# Altium project wiz55stm32.PrjPcb
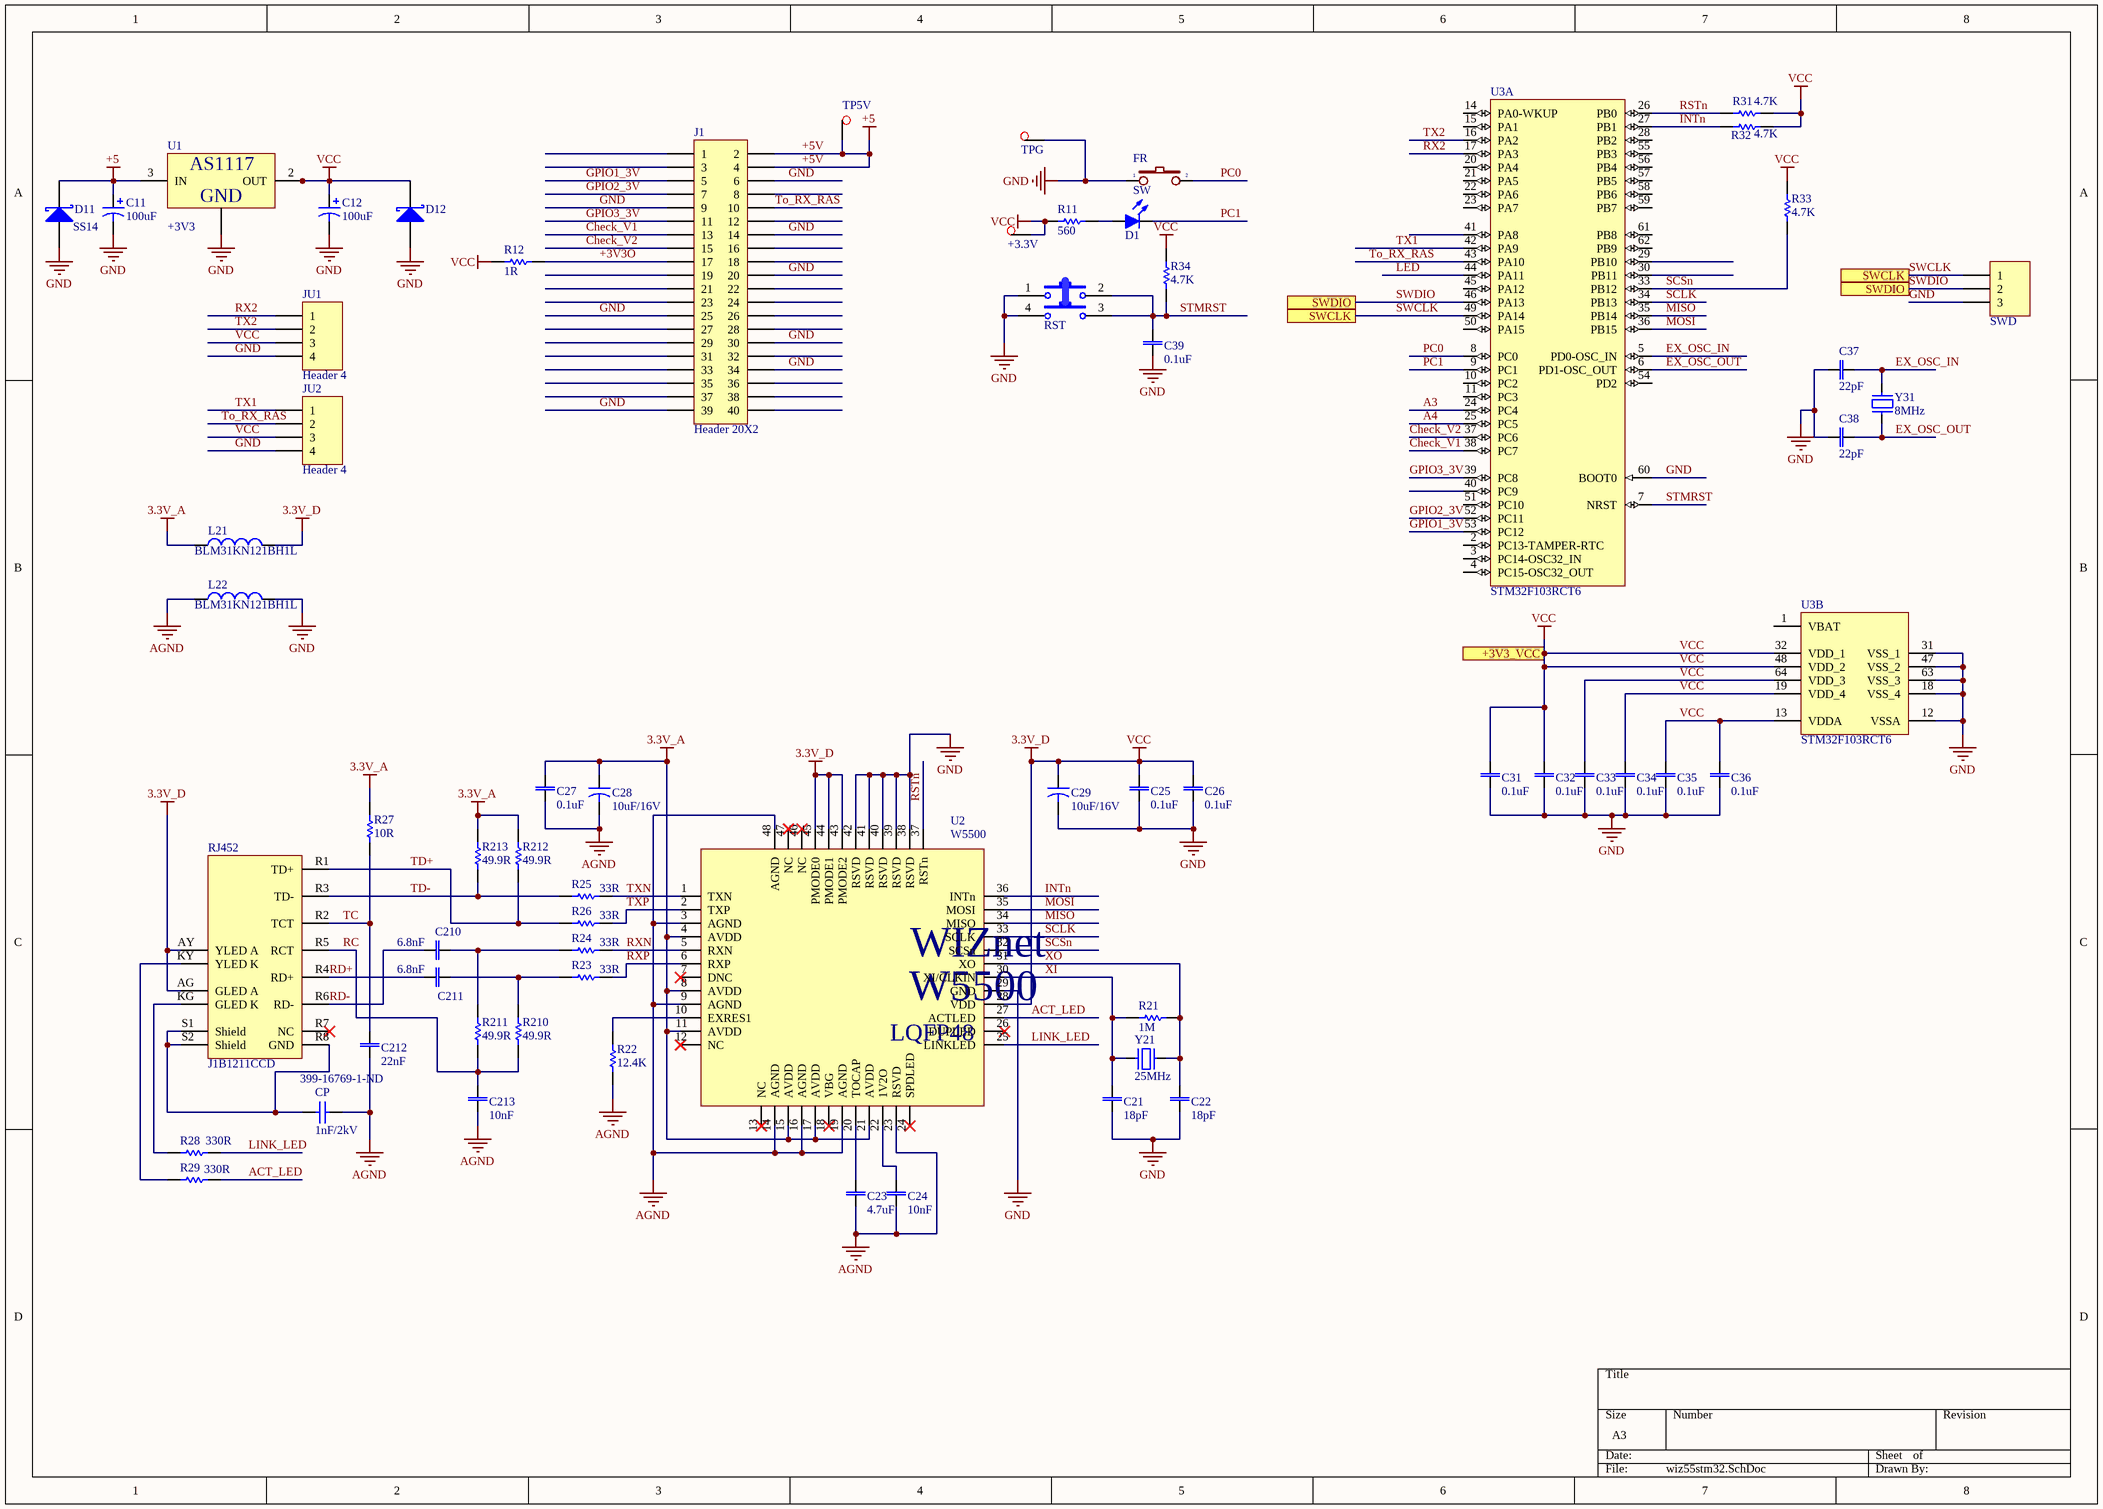
[diagram p0: wiz55stm32.SchDoc]
1 sheet, 64 parts. Net scope: flat (ports and power ports of the same name join across sheets).
Board file: wiz55stm32.PcbDoc

## Sheet wiz55stm32.SchDoc
size A3

### Parts
+3.3V  TP  [TP2]  (value not drawn)
C11  value 100uF  [CAP 3.8mm]  (hidden comment: Cap)
C12  value 100uF  [CAP 3.8mm]  (hidden comment: Cap)
C21  value 18pF  [CAP 0805]  (hidden comment: Tụ điện dán 080518pF)
C22  value 18pF  [CAP 0805]  (hidden comment: Tụ điện dán 080518pF)
C23  value 4.7uF  [CAP 0805]  (hidden comment: Tụ điện dán 08054.7uF)
C24  value 10nF  [CAP 0805]  (hidden comment: Tụ điện dán 080510nF)
C25  value 0.1uF  [CAP 0805]  (hidden comment: Tụ điện dán 08050.1uF)
C26  value 0.1uF  [CAP 0805]  (hidden comment: Tụ điện dán 08050.1uF)
C27  value 0.1uF  [CAP 0805]  (hidden comment: Tụ điện dán 08050.1uF)
C28  10uF/16V  [CAP-A Size]
C29  10uF/16V  [CAP-A Size]
C31  value 0.1uF  [CAP 0805]  (hidden comment: Tụ điện dán 08050.1uF)
C32  value 0.1uF  [CAP 0805]  (hidden comment: Tụ điện dán 08050.1uF)
C33  value 0.1uF  [CAP 0805]  (hidden comment: Tụ điện dán 08050.1uF)
C34  value 0.1uF  [CAP 0805]  (hidden comment: Tụ điện dán 08050.1uF)
C35  value 0.1uF  [CAP 0805]  (hidden comment: Tụ điện dán 08050.1uF)
C36  value 0.1uF  [CAP 0805]  (hidden comment: Tụ điện dán 08050.1uF)
C37  value 22pF  [CAP 0805]  (hidden comment: Tụ điện dán 080522pF)
C38  value 22pF  [CAP 0805]  (hidden comment: Tụ điện dán 080522pF)
C39  value 0.1uF  [CAP 0805]  (hidden comment: Tụ điện dán 08050.1uF)
C210  value 6.8nF  [CAP 0805]  (hidden comment: Tụ điện dán 08056.8nF)
C211  value 6.8nF  [CAP 0805]  (hidden comment: Tụ điện dán 08056.8nF)
C212  value 22nF  [CAP 0805]  (hidden comment: Tụ điện dán 080522nF)
C213  value 10nF  [CAP 0805]  (hidden comment: Tụ điện dán 080510nF)
CP  1nF/2kV  Supplier Part Number 1: 399-16769-1-ND  [CAP-1808]
D1  Led  [LED 5mm Green]  (value not drawn)
D11  value SS14  [DO-214AC]  (hidden comment: Đi ốt dánSS14)
D12  Đi ốt dánPN:CPDH3V3UP  [DO-35]  (value not drawn)
FR  SW  [SW2-D1]
J1  Header 20X2  [HDR2X20]
JU1  Header 4  [HDR1X4]
JU2  Header 4  [HDR1X4]
L21  BLM31KN121BH1L  [SMD 1206]
L22  BLM31KN121BH1L  [SMD 1206]
R11  value 560  [RES 0805]  (hidden comment: Điện trở dán 0603560)
R12  value 1R  [RES 0805]  (hidden comment: Điện trở dán 08051R)
R21  value 1M  [RES 0805]  (hidden comment: Điện trở dán 08051M)
R22  value 12.4K  [RES 0805]  (hidden comment: Điện trở dán 080512.4K)
R23  value 33R  [RES 0805]  (hidden comment: Điện trở dán 080533R)
R24  value 33R  [RES 0805]  (hidden comment: Điện trở dán 080533R)
R25  value 33R  [RES 0805]  (hidden comment: Điện trở dán 080533R)
R26  value 33R  [RES 0805]  (hidden comment: Điện trở dán 080533R)
R27  value 10R  [RES 0805]  (hidden comment: Điện trở dán 080510R)
R28  value 330R  [RES 0805]  (hidden comment: Điện trở dán 0805330R)
R29  value 330R  [RES 0805]  (hidden comment: Điện trở dán 0805330R)
R31  value 4.7K  [RES 0805]  (hidden comment: Điện trở dán 08054.7K)
R32  value 4.7K  [RES 0805]  (hidden comment: Điện trở dán 08054.7K)
R33  value 4.7K  [RES 0805]  (hidden comment: Điện trở dán 08054.7K)
R34  value 4.7K  [RES 0805]  (hidden comment: Điện trở dán 08054.7K)
R210  value 49.9R  [RES 0805]  (hidden comment: Điện trở dán 080549.9R)
R211  value 49.9R  [RES 0805]  (hidden comment: Điện trở dán 080549.9R)
R212  value 49.9R  [RES 0805]  (hidden comment: Điện trở dán 080549.9R)
R213  value 49.9R  [RES 0805]  (hidden comment: Điện trở dán 080549.9R)
RJ452  J1B1211CCD  [J1B1211CCD]
RST  Nút bấm 4 chân cắm12x12x6mm  [SW]  (value not drawn)
SWD  Header 3  [HDR1X3]  (value not drawn)
TP5V  TP  [TP2]  (value not drawn)
TPG  TP  [TP2]  (value not drawn)
U1  vl: +3V3  [SOT223-4N]  (hidden comment: IC nguồn AS1117 dán+3V3)
U2  W5500  [WIZnet W5500]
U3  STM32F103RCT6  [LQFP64_Tuan]  (parts A,B of 2)
Y21  25MHz  [XT2]
Y31  8MHz  [XT2]

### Ports
+3V3_VCC, SWCLK, SWDIO

### Nets
3.3V_A: C27.2 C28.1 L21.1 R27.1 R212.2 R213.2 U2.4(AVDD) U2.8(AVDD) U2.11(AVDD) U2.15(AVDD) U2.17(AVDD) U2.21(AVDD)
+5V: C11.1 D11.K J1.2 J1.4 TP5V.1 U1.3(IN)  [also labelled +5]
AGND: C23.1 C24.1 C27.1 C28.2 C212.2 C213.2 CP.1 L22.1 R22.1 U2.3(AGND) U2.9(AGND) U2.14(AGND) U2.16(AGND) U2.19(AGND) U2.23(RSVD) U2.48(AGND)
GND: C11.2 C12.2 C21.1 C22.1 C25.1 C26.1 C29.2 C31.1 C32.1 C33.1 C34.1 C35.1 C36.1 C37.2 C38.2 C39.1 D11.A D12.A FR.1 J1.6 J1.9 J1.14 J1.20 J1.25 J1.30 J1.34 J1.39 JU1.4 JU2.4 L22.2 RST.1 RST.4 SWD.3 TPG.1 U1.1(GND) U2.29(GND) U2.38(RSVD) U2.39(RSVD) U2.40(RSVD) U2.41(RSVD) U2.42(RSVD) U3.12(VSSA) U3.18(VSS_4) U3.31(VSS_1) U3.47(VSS_2) U3.60(BOOT0) U3.63(VSS_3)
VCC: +3.3V.1 C12.1 C25.2 C26.2 C29.1 C31.2 C32.2 C33.2 C34.2 C35.2 C36.2 D12.K JU1.3 JU2.3 L21.2 R11.1 R12.1 R31.1 R32.1 R33.2 R34.2 RJ452.AG(GLED_A) RJ452.AY(YLED_A) U1.2(OUT) U1.4 U2.28(VDD) U2.43(PMODE2) U2.44(PMODE1) U2.45(PMODE0) U3.13(VDDA) U3.19(VDD_4) U3.32(VDD_1) U3.48(VDD_2) U3.64(VDD_3) ; port +3V3_VCC  [also labelled 3.3V_D]
+3V3O: J1.17 R12.2
A3: U3.24(PC4)
A4: U3.25(PC5)
ACT_LED: R29.2 U2.27(ACTLED)
Check_V1: J1.13 U3.38(PC7)
Check_V2: J1.15 U3.37(PC6)
EX_OSC_IN: C37.1 U3.5(PD0-OSC_IN) Y31.2
EX_OSC_OUT: C38.1 U3.6(PD1-OSC_OUT) Y31.1
GPIO1_3V: J1.5 U3.53(PC12)
GPIO2_3V: J1.7 U3.52(PC11)
GPIO3_3V: J1.11 U3.39(PC8)
INTn: R32.2 U2.36(INTn) U3.27(PB1)
LED: U3.44(PA11)
LINK_LED: R28.2 U2.25(LINKLED)
MISO: U2.34(MISO) U3.35(PB14)
MOSI: U2.35(MOSI) U3.36(PB15)
PC0: FR.2 U3.8(PC0)
PC1: D1.K U3.9(PC1)
RC: C213.1 R210.1 R211.1 RJ452.R5(RCT)
RD+: C211.2 RJ452.R4(RD+)
RD-: C210.2 RJ452.R6(RD-)
RSTn: R31.2 U2.37(RSTn) U3.26(PB0)
RX2: JU1.1 U3.17(PA3)
RXN: R24.1 U2.5(RXN)
RXP: R23.1 U2.6(RXP)
SCLK: U2.33(SCLK) U3.34(PB13)
SCSn: R33.1 U2.32(SCSn) U3.33(PB12)
STMRST: C39.2 R34.1 RST.2 RST.3 U3.7(NRST)
SWCLK: SWD.1 U3.49(PA14) ; port SWCLK
SWDIO: SWD.2 U3.46(PA13) ; port SWDIO
TC: C212.1 R27.2 RJ452.R2(TCT)
TD+: R26.2 R212.1 RJ452.R1(TD+)
TD-: R25.2 R213.1 RJ452.R3(TD-)
To_RX_RAS: J1.10 JU2.2 U3.43(PA10)
TX1: JU2.1 U3.42(PA9)
TX2: JU1.2 U3.16(PA2)
TXN: R25.1 U2.1(TXN)
TXP: R26.1 U2.2(TXP)
XI: C21.2 R21.1 U2.30(XI/CLKIN) Y21.1
XO: C22.2 R21.2 U2.31(XO) Y21.2
NetC23_2: C23.2 U2.20(TOCAP)
NetC24_2: C24.2 U2.22(1V2O)
NetC210_1: C210.1 R24.2 R211.2
NetC211_1: C211.1 R23.2 R210.2
NetCP_2: CP.2 RJ452.R8(GND) RJ452.S1(Shield) RJ452.S2(Shield)
NetD1_A: D1.A R11.2
NetR22_2: R22.2 U2.10(EXRES1)
NetR28_1: R28.1 RJ452.KG(GLED_K)
NetR29_1: R29.1 RJ452.KY(YLED_K)

Not connected (* = marked no-connect by the designer): J1 1 3 8 12 16 18 19 21 22 23 24 26 27 28 29 31 32 33 35 36 37 38 40; RJ452 R7(NC)*; U2 7(DNC)* 12(NC)* 13(NC)* 18(VBG)* 24(SPDLED)* 26(DUPLED)* 46(NC)* 47(NC)*; U3 1(VBAT) 2(PC13-TAMPER-RTC) 3(PC14-OSC32_IN) 4(PC15-OSC32_OUT) 10(PC2) 11(PC3) 14(PA0-WKUP) 15(PA1) 20(PA4) 21(PA5) 22(PA6) 23(PA7) 28(PB2) 29(PB10) 30(PB11) 40(PC9) 41(PA8) 45(PA12) 50(PA15) 51(PC10) 54(PD2) 55(PB3) 56(PB4) 57(PB5) 58(PB6) 59(PB7) 61(PB8) 62(PB9)

### Notes on the sheet
- (in symbol W5500) WIZnet; LQFP48

### Library data of the parts
C21-C27 C31-C39 C210-C213 = CAP NP: Capacitor non polarized; cm1: Tụ điện dán 0603; cm3: Tụ điện dán 1206; cm2: Tụ điện dán 0805
C28 C29 = CAP-A Size: Tantla CAP A Size EIA/IECQ 3216
CP = CAP-1808: Ceramic CAP 1808(4520); Manufacturer 1: KEMET; Manufacturer Part Number 1: C1808C102MGRACAUTO; Capacitance: 1nF; Tolerance: 20%; Voltage Rating: 2kV; Supplier 1: Digi-Key; Stock 1: 3356; Pricing 1: 1=0.74000, 10=0.52000, 100=0.34230, 500=0.25358 (USD); RoHS: No; Mount: Surface Mount; Case/Package: 1808; Case Code (Imperial): 1808; Case Code (Metric): 4520; Min Operating Temperature: -55°C; Max Operating Temperature: 125°C; Packaging: Tape and Reel; Ratings: AEC-Q200; ComponentLink1URL: https://api.kemet.com/component-edge/download/datasheet/C1808C102MGRACAUTO.pdf?src-supplier=Digi-Key; ComponentLink1Description: https://api.kemet.com/component-edge/download/datasheet/C1808C102MGRACAUTO.pdf?src-supplier=Digi-Key
D1 = Led: pin to pad: A>1 K>2
D11 = Diodes Schottky: Schottky Diodes Through Hole 3 A 40 V Schottky Diodes, DO-201AD, SB340 ,MBR340; cm1: Đi ốt cắm; cm2: Đi ốt dán
D12 = Diodes Schottky: Zener 3.3V/1W; cm1: Đi ốt cắm; cm2: Đi ốt dán; Value: PN:CPDH3V3UP
FR = SW2: Switch button 2 pin; Value: SW chip 2 pin
J1 = Header 20X2: Header, 20-Pin, Dual row; LatestRevisionDate: 17-Jul-2002; LatestRevisionNote: Re-released for DXP Platform.; Publisher: Altium Limited
JU1 JU2 = Header 4: Header, 4-Pin; LatestRevisionDate: 17-Jul-2002; LatestRevisionNote: Re-released for DXP Platform.; Publisher: Altium Limited
L21 L22 = IND-0603: Ferrite Beads 1206 120ohms 4A AEC-Q200
R11 = Res: Resistor; cm2: Điện trở cắm 1/4W; cm3: Điện trở dán 0805; cm4: Điện trở dán 1206; cm1: Điện trở dán 0603
R12 R21-R29 R31-R34 R210-R213 = Res: Resistor; cm1: Điện trở dán 0603; cm2: Điện trở cắm 1/4W; cm4: Điện trở dán 1206; cm3: Điện trở dán 0805
RJ452 = BS-R250210
RST = SW-4P-Small: cm1: Nút bấm 4 chân cắm; vl1: 12x12x6mm
SWD = Header 3: Header, 3-Pin; LatestRevisionDate: 17-Jul-2002; LatestRevisionNote: Re-released for DXP Platform.; Publisher: Altium Limited
U1 = AS1117: cm: IC nguồn AS1117 dán
U2 = W5500: WIZnet W5500
U3 = STM32F103RCT6: ARM Cortex-M3 32-bit MCU, 256 KB Flash, 48 KB Internal RAM, 51 I/Os, 64-pin LQFP, -40 to 85 degC, Tray; A/D Converter: 3x12-bit (16 Channel); D/A Converter: 2x12-bit (2 Channel); FLASH Size (Prog) (kB): 256; I/Os (High Current): 51; Internal RAM Size (kB): 48; Operating Frequency(F) (Processor speed) (MHz): 72; Supply Voltage(Vcc) min (V): 2; DatasheetVersion: Rev. 8; PackageVersion: Rev. 4, 06/2013; PackageReference: LQFP64; PackageDescription: 64-Pin Low Profile Quad Flat Package, 10 x 10 mm Body, 0.5 mm Pitch; Supplier 1: Digi-Key; Supplier Part Number 1: 497-9033-ND; Supplier 2: Newark; Supplier Part Number 2: 01P4099; Supplier 3: Newark; Supplier Part Number 3: 57P1227; Supplier 4: Mouser; Supplier Part Number 4: 511-STM32F103RCT6; Core: ARM Cortex-M3; Packing: Tray; Mounting Technology: Surface Mount; PartNumber: STM32F103RCT6; ComponentLink1Description: Manufacturer URL; ComponentLink1URL: http://www.st.com/web/en/home.html; ComponentLink2Description: Datasheet; ComponentLink2URL: http://www.st.com/st-web-ui/static/active/en/resource/technical/document/datasheet/CD00191185.pdf; ComponentLink3Description: Package Specification; ComponentLink3URL: http://www.st.com/st-web-ui/static/active/en/resource/technical/document/datasheet/DM00037051.pdf
Y21 Y31 = Crystal